# EAGLE design project (EAGLE 9.4.2)
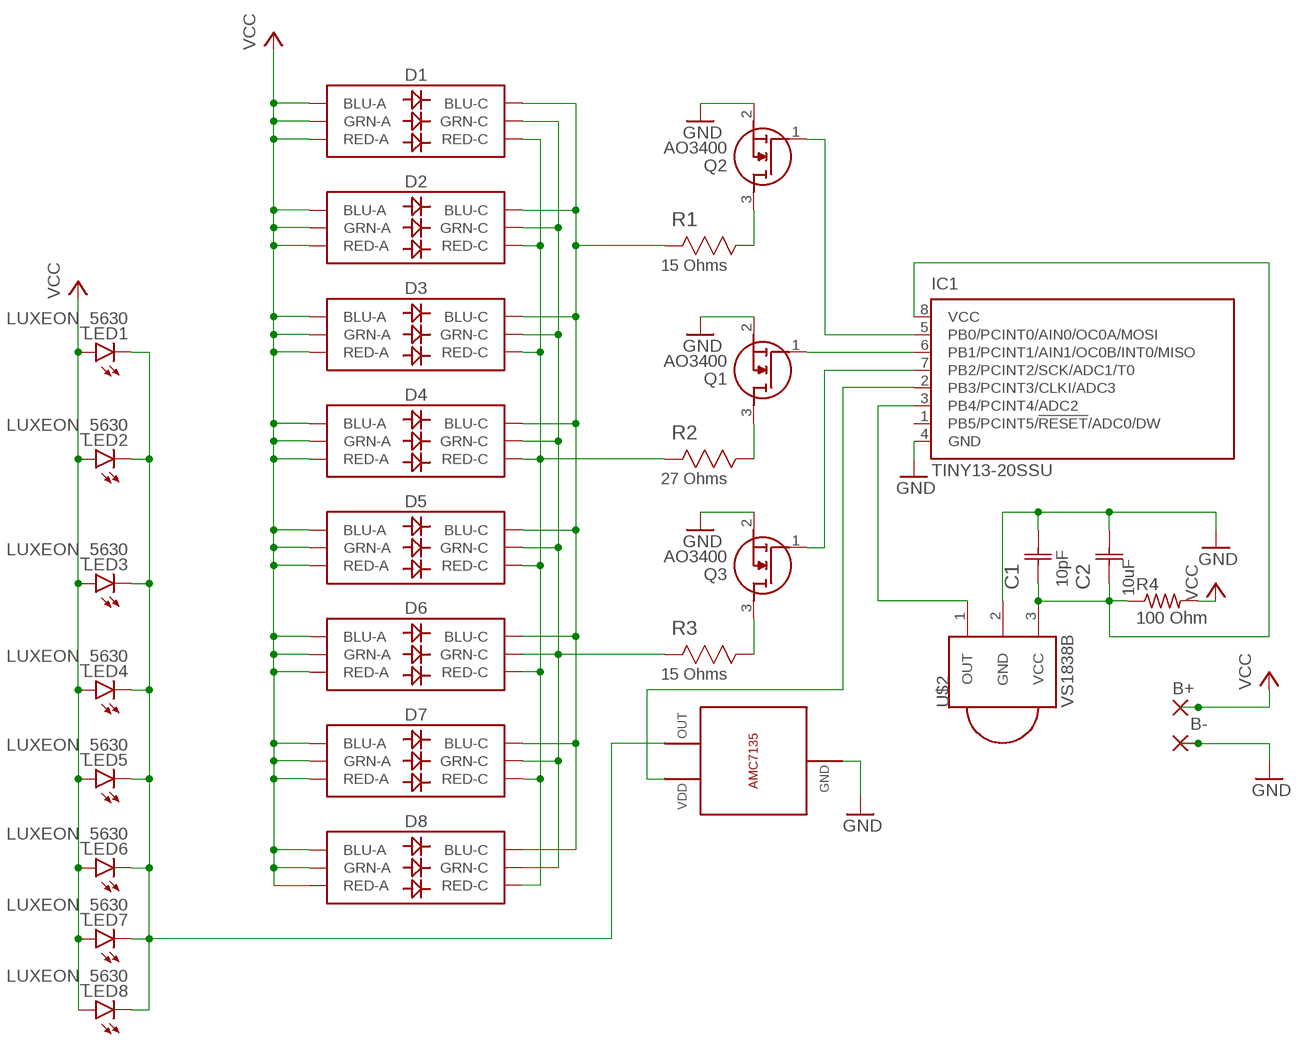
[diagram p0: schematic, sheet 1]

## Parts
B+  WIREPADSMD1,27-254  [SMD1,27-2,54]
B-  WIREPADSMD1,27-254  [SMD1,27-2,54]
C1  10pF  08051A100JAT2A  [CAPC2013X94N]
C2  10uF  12061A101JAT2A  [CAPC3216X94N]
D1  LED-RGBNO_IC  [LED-TRICOLOR-5050]
D2  LED-RGBNO_IC  [LED-TRICOLOR-5050]
D3  LED-RGBNO_IC  [LED-TRICOLOR-5050]
D4  LED-RGBNO_IC  [LED-TRICOLOR-5050]
D5  LED-RGBNO_IC  [LED-TRICOLOR-5050]
D6  LED-RGBNO_IC  [LED-TRICOLOR-5050]
D7  LED-RGBNO_IC  [LED-TRICOLOR-5050]
D8  LED-RGBNO_IC  [LED-TRICOLOR-5050]
IC1  TINY13-20SSU  [8S1]
LED1  LUXEON_5630  [LUXEON_5630]
LED2  LUXEON_5630  [LUXEON_5630]
LED3  LUXEON_5630  [LUXEON_5630]
LED4  LUXEON_5630  [LUXEON_5630]
LED5  LUXEON_5630  [LUXEON_5630]
LED6  LUXEON_5630  [LUXEON_5630]
LED7  LUXEON_5630  [LUXEON_5630]
LED8  LUXEON_5630  [LUXEON_5630]
Q1  AO3400  [SOT95P280X125-3N]
Q2  AO3400  [SOT95P280X125-3N]
Q3  AO3400  [SOT95P280X125-3N]
R1  15 Ohms  CRCW1206130RFKEA  [RESC3216X71N]
R2  27 Ohms  CRCW1206130RFKEA  [RESC3216X71N]
R3  15 Ohms  CRCW1206130RFKEA  [RESC3216X71N]
R4  100 Ohm  R-US_R0805  [R0805]
U$1  AMC7135  [AMC7135]
U$2  VS1838B  PNA460XM  [PNA460XM]

## Nets
GND: B-.1(P) C1.2(C2) C2.2(C2) IC1.4(GND) Q1.2(S) Q2.2(S) Q3.2(S) U$1.GND U$1.TAB(GND) U$2.2(GND)
N$1: LED1.1@1(C) LED1.1@2(C) LED2.1@1(C) LED2.1@2(C) LED3.1@1(C) LED3.1@2(C) LED4.1@1(C) LED4.1@2(C) LED5.1@1(C) LED5.1@2(C) LED6.1@1(C) LED6.1@2(C) LED7.1@1(C) LED7.1@2(C) LED8.1@1(C) LED8.1@2(C) U$1.OUT
N$2: IC1.5(PB0/PCINT0/AIN0/OC0A/MOSI) Q2.1(G)
N$3: IC1.6(PB1/PCINT1/AIN1/OC0B/INT0/MISO) Q1.1(G)
N$4: IC1.7(PB2/PCINT2/SCK/ADC1/T0) Q3.1(G)
N$5: Q2.3(D) R1.1(R1)
N$6: Q1.3(D) R2.1(R1)
N$7: Q3.3(D) R3.1(R1)
N$8: D1.5(RED-C) D2.5(RED-C) D3.5(RED-C) D4.5(RED-C) D5.5(RED-C) D6.5(RED-C) D7.5(RED-C) D8.5(RED-C) R2.2(R2)
N$9: D1.6(GRN-C) D2.6(GRN-C) D3.6(GRN-C) D4.6(GRN-C) D5.6(GRN-C) D6.6(GRN-C) D7.6(GRN-C) D8.6(GRN-C) R3.2(R2)
N$10: D1.4(BLU-C) D2.4(BLU-C) D3.4(BLU-C) D4.4(BLU-C) D5.4(BLU-C) D6.4(BLU-C) D7.4(BLU-C) D8.4(BLU-C) R1.2(R2)
N$11: IC1.3(PB4/PCINT4/ADC2) U$2.1(OUT)
N$12: IC1.2(PB3/PCINT3/CLKI/ADC3) U$1.VDD
N$14: C1.1(C1) C2.1(C1) IC1.8(VCC) R4.1 U$2.3(VCC)
VCC: B+.1(P) D1.1(GRN-A) D1.2(RED-A) D1.3(BLU-A) D2.1(GRN-A) D2.2(RED-A) D2.3(BLU-A) D3.1(GRN-A) D3.2(RED-A) D3.3(BLU-A) D4.1(GRN-A) D4.2(RED-A) D4.3(BLU-A) D5.1(GRN-A) D5.2(RED-A) D5.3(BLU-A) D6.1(GRN-A) D6.2(RED-A) D6.3(BLU-A) D7.1(GRN-A) D7.2(RED-A) D7.3(BLU-A) D8.1(GRN-A) D8.2(RED-A) D8.3(BLU-A) LED1.2(A) LED2.2(A) LED3.2(A) LED4.2(A) LED5.2(A) LED6.2(A) LED7.2(A) LED8.2(A) R4.2
Unconnected: IC1.1(PB5/PCINT5/!RESET!/ADC0/DW)

## Library data of the parts
B+ B- = wirepad:WIREPAD: Wire PAD connect wire on PCB
C1 = C_0805:08051A100JAT2A: Capacitor 0805; MPN: 08051A100JAT2A; OC_FARNELL: 499158; OC_NEWARK: 96K4767; SUPPLIER: AVX; TOLERANCE: ±5%; VOLTAGERATING: 100V
C2 = C_1206:12061A101JAT2A; DESCRIPTION: Capacitor 1206; MPN: 12061A101JAT2A; OC_FARNELL: 499274; OC_NEWARK: 27C4497; SUPPLIER: AVX; TOLERANCE: ±5%; VALUE: 100PF; VOLTAGERATING: 100V
D1-D8 = SparkFun-LED:LED-RGB: LED-RGB 6 pin RGB LED (no common connector) Packages: PLCC-6 LED-TRICOLOR-5050 - No built-in IC SparkFun Products: Digital Sandbox <https://www.sparkfun.com/products/12651> LED- SMD RGB <https://www.sparkfun.com/products/10866>; PROD_ID: DIO-10298
IC1 = atmel:TINY13: 8-bit AVR Microcontroller with 1K Bytes In-System Programmable Flash Source: http://www.atmel.com/dyn/resources/prod_documents/2535S.pdf; MPN: ATTINY13-20SSU; OC_FARNELL: 1455133; OC_NEWARK: 58M3771
LED1-LED8 = led:LUXEON_5630: LUXEON 5630 Mid-Power LEDs SD201 Source: Data sheet <www.philipslumileds.com/uploads/351/DS201-pdf> Lumileds 5630 Datasheet DS201 20130228 ©2013 Philips Lumileds Lighting Company.
Q1-Q3 = AO3400:AO3400: 30V N-Channel MOSFET Source: Datasheet <http://aosmd.com/res/data_sheets/AO3400.pdf>; ARROW_PART_NUMBER: AO3400; ARROW_PRICE/STOCK: https://www.arrow.com/en/products/ao3400/alpha-and-omega-semiconductor; DESCRIPTION: 30V N-Channel MOSFET; HEIGHT: 1.25mm; MANUFACTURER_NAME: Alpha & Omega Semiconductors; MANUFACTURER_PART_NUMBER: AO3400
R1-R3 = R_1206:CRCW1206130RFKEA: RESISTOR, 1206; MPN: CRCW1206130RFKEA; OC_FARNELL: 1692541; OC_NEWARK: 53K1973; SUPPLIER: Vishay; TOLERANCE: ±1%; VALUE: 130 Ohms; WATTAGE: 0.25W
R4 = rcl:R-US_: RESISTOR, American symbol; SPICEPREFIX: R
U$1 = dan:AMC7135
U$2 = adafruit:PNA460XM: IR 38KHz receiver PNA4602 and related receivers http://www.ladyada.net/library/pcb/eaglelibrary.html

## Board
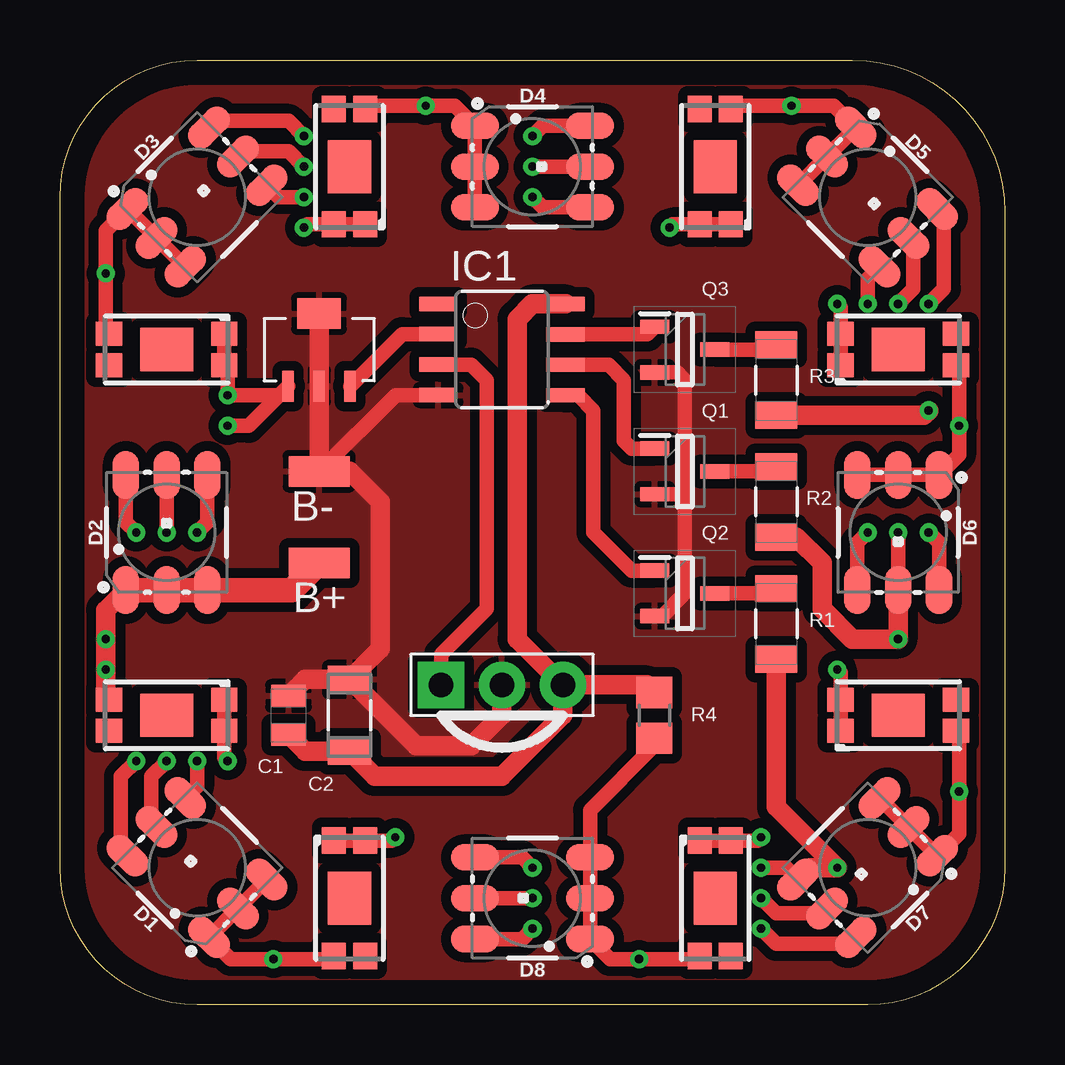
[diagram p1: board, top side]
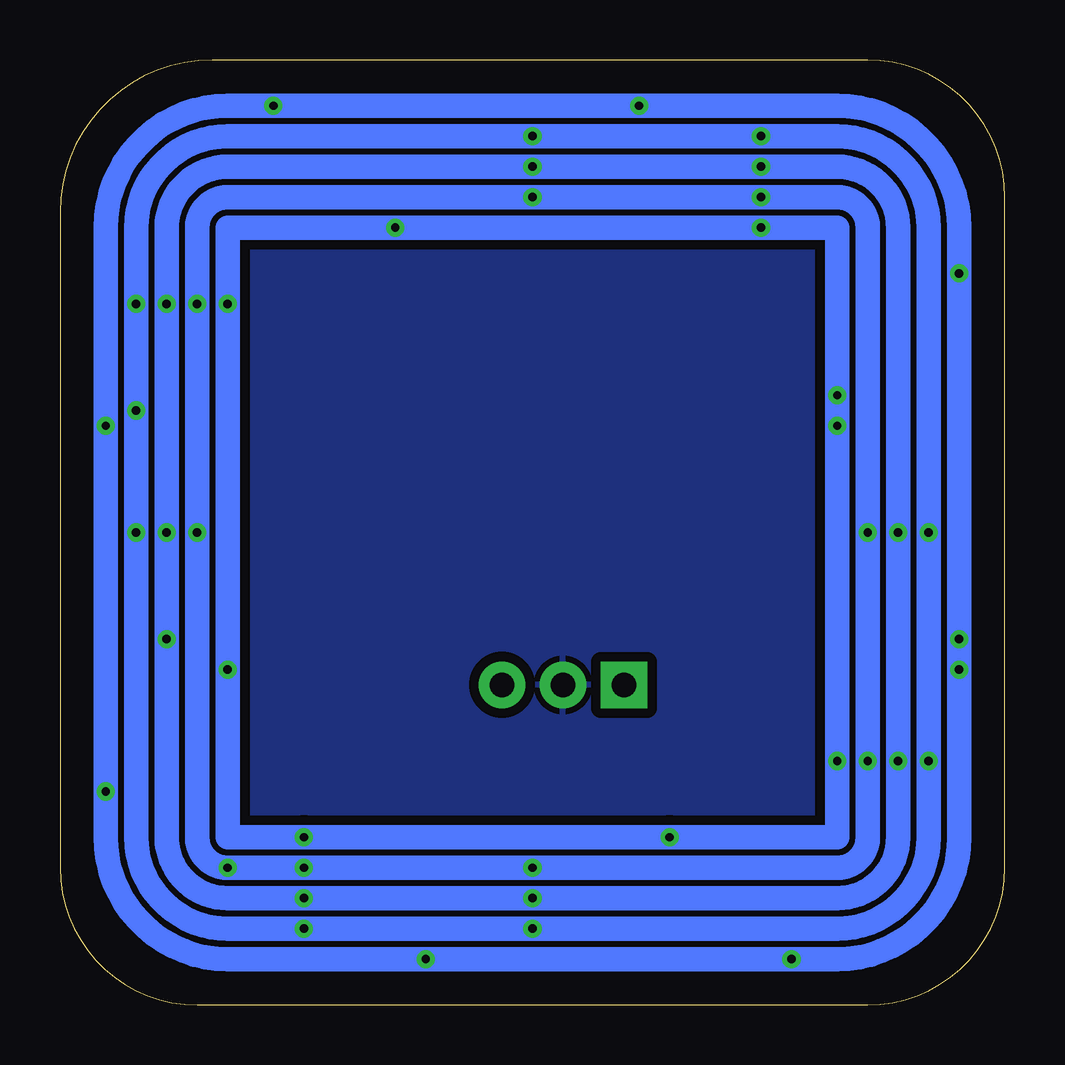
[diagram p2: board, bottom side, seen from below]

Size 39.37 x 39.37 mm. Coordinates in mm from the lower left corner, seen from the top.
Outline: 33.02,39.37 arc-90 39.37,33.02 39.37,5.71 arc-90 33.66,0 5.71,0 arc-90 0,5.71 0,33.66 arc-90 5.71,39.37 33.02,39.37
Copper layers (1*16): Top 0.035mm / dielectric 1.5mm / Bottom 0.035mm
Design rules "default *": minimum track width 6mil, minimum drill 0.35mm, track to track 6mil, track to pad 6mil, pad to pad 6mil, via to via 6mil, smd to smd 6mil, copper to edge 40mil, drill to drill 6mil, minimum pad ring 10mil, minimum via ring 8mil, stop-mask expansion 4mil, vias tented up to drill 14mil, thermal gap 10mil

### Footprints (pad centres in the part's own frame; a part is rotated, then mirrored left to right if it is on the bottom)
SMD1,27-2,54 = smd 1.27 x 2.54: 1 0,0
CAPC2013X94N = smd 0.914 x 1.448: 1 -0.813,0; 2 0.813,0
CAPC3216X94N = smd 1.118 x 1.803: 1 -1.499,0; 2 1.499,0
LED-TRICOLOR-5050 = smd 2 x 1.1: 1 -2.4,1.7; 2 -2.4,0; 3 -2.4,-1.7; 4 2.4,-1.7; 5 2.4,0; 6 2.4,1.7
8S1 = smd 0.6 x 1.6: 1 -1.905,-2.654; 2 -0.645,-2.654; 3 0.625,-2.654; 4 1.895,-2.654; 5 1.905,2.654; 6 0.635,2.654; 7 -0.635,2.654; 8 -1.905,2.654
LUXEON_5630 = smd 1.1 x 1: 1@1 -2.4,-0.65; 1@2 -2.4,0.65; 2 2.4,-0.65; 4 2.4,0.65 | smd 2.2 x 1.8: 3 0,0
SOT95P280X125-3N = smd 1.2 x 0.6: 1 -1.25,0.95; 2 -1.25,-0.95; 3 1.25,0
RESC3216X71N = smd 1.118 x 1.753: 1 -1.473,0; 2 1.473,0
R0805 = smd 1.3 x 1.5: 1 -0.95,0; 2 0.95,0
AMC7135 = smd 0.48 x 1.29: GND 0,-1.525; OUT -1.29,-1.525; VDD 1.29,-1.525 | smd 1.82 x 1.27: TAB 0,1.499
PNA460XM = drill 1.016 pad 1.93 square: 1 -2.54,0 | drill 1.016 pad 1.93: 2 0,0; 3 2.54,0

### Placement (x,y rotation side)
B+  10.79,18.41 90 top
B-  10.79,22.23 90 top
C1  9.53,12.06 90 top
C2  12.06,12.06 90 top
D1  5.71,5.71 135 top
D2  4.45,19.68 90 top
D3  5.71,33.66 45 top
D4  19.68,34.92 0 top
D5  33.66,33.66 315 top
D6  34.92,19.68 270 top
D7  33.66,5.71 225 top
D8  19.68,4.45 180 top
IC1  18.41,27.3 270 top
LED1  4.45,12.06 180 top
LED2  4.45,27.3 180 top
LED3  12.06,34.92 90 top
LED4  27.3,34.92 90 top
LED5  34.92,27.3 0 top
LED6  34.92,12.06 0 top
LED7  27.3,4.45 270 top
LED8  12.06,4.45 270 top
Q1  26.04,22.23 0 top
Q2  26.04,17.14 0 top
Q3  26.04,27.3 0 top
R1  29.84,15.88 270 top
R2  29.84,20.95 270 top
R3  29.84,26.04 270 top
R4  24.77,12.06 270 top
U$1  10.79,27.3 0 top
U$2  18.41,13.34 0 top

### Tracks (layer width: path | path; a pad name or v marks a point on that pad's centre or on a via)
GND
  Top 0.61: IC1.4 13.98,25.41 B-.1 | Q3.2 25.71,26.36 26.04,26.04 26.04,20.95 | 26.04,20.95 26.04,17.14 25.09,16.2 Q2.2 | Q1.2 25.71,21.27 26.04,20.95
  Top 0.813: C2.2 14.83,10.79 17.14,10.79 18.41,12.06 U$2.2 | C1.2 10.21,13.56 C2.2 | C2.2 13.34,14.83 13.34,20.95 12.06,22.23 B-.1 U$1.GND U$1.TAB
  pour Bottom (isolate 0.406): 5.71,33.66 33.66,33.66 33.66,5.71 5.71,5.71
  pour Top (isolate 0.406): -1.27,39.37 0,40.64 40.64,40.64 40.64,1.27 38.1,-1.27 31.75,-1.27 0,-1.27 -1.91,0.64 -1.91,38.73
N$1  (via drill 0.35)
  Top 0.61: v10.16,32.38 10.3,32.52 LED3.1@2 LED3.1@1 | v6.99,10.16 6.84,10.3 LED1.1@2 LED1.1@1 | v13.97,6.99 13.83,6.84 LED8.1@2 LED8.1@1 | v29.21,6.99 29.07,6.84 LED7.1@2 LED7.1@1 | v32.38,13.97 32.52,13.83 LED6.1@2 LED6.1@1 | v32.38,29.21 32.52,29.07 LED5.1@2 LED5.1@1 | v25.4,32.38 25.54,32.52 LED4.1@2 LED4.1@1 | v6.99,24.13 7.86,24.13 U$1.OUT 9.12,25.4 v6.99,25.4 6.99,26.52 LED2.1@2 LED2.1@1
  Bottom 1.016: 32.38,32.38 v32.38,29.21 v32.38,13.97 32.38,6.99 v29.21,6.99 v13.97,6.99 6.99,6.99 v6.99,10.16 v6.99,24.13 v6.99,25.4 6.99,32.38 v10.16,32.38 v25.4,32.38 32.38,32.38
N$2
  Top 0.61: IC1.5 21.59,25.4 22.23,24.77 22.23,19.68 23.82,18.09 Q2.1
N$3
  Top 0.61: IC1.6 22.86,26.67 23.5,26.04 23.5,23.5 23.82,23.18 Q1.1
N$4
  Top 0.61: IC1.7 24.47,27.94 Q3.1
N$5
  Top 0.61: Q2.3 29.64,17.14 R1.1
N$6
  Top 0.61: Q1.3 29.64,22.23 R2.1
N$7
  Top 0.61: Q3.3 29.64,27.3 R3.1
N$8  (via drill 0.35)
  Top 0.61: v19.68,34.92 D4.5 | D6.5 v34.92,19.68 | D8.5 v19.68,4.45 | D2.5 v4.45,19.68 | v10.16,34.92 9.53,35.56 7.62,35.56 D3.5 | v34.92,29.21 35.56,29.84 35.56,31.75 D5.5 | v29.21,4.45 29.84,3.81 31.75,3.81 D7.5 | v4.45,10.16 3.81,9.53 3.81,7.62 D1.5
  Top 0.813: R2.2 30.68,19.48 31.75,18.41 31.75,16.51 33.02,15.24 v34.92,15.24 D6.5
  Bottom 1.016: 32.38,34.92 arc-90 34.92,32.38 v34.92,29.21 v34.92,19.68 v34.92,15.24 34.92,6.99 arc-90 32.38,4.45 v29.21,4.45 v19.68,4.45 6.99,4.45 arc-90 4.45,6.99 v4.45,10.16 v4.45,19.68 4.45,32.38 arc-90 6.99,34.92 v10.16,34.92 v19.68,34.92 32.38,34.92
N$9  (via drill 0.35)
  Top 0.61: v19.68,36.2 20.11,36.62 D4.6 | D6.6 36.62,19.25 v36.2,19.68 | D8.6 19.25,2.75 v19.68,3.17 | D2.6 2.75,20.11 v3.17,19.68 | v10.16,36.2 9.53,36.83 6.49,36.83 D3.6 | v36.2,29.21 36.83,29.84 36.83,32.88 D5.6 | v29.21,3.17 29.84,2.54 32.88,2.54 D7.6 | v3.17,10.16 2.54,9.53 2.54,6.49 D1.6
  Top 0.813: R3.2 35.99,24.56 v36.2,24.77
  Bottom 1.016: 32.38,36.2 arc-90 36.2,32.38 v36.2,29.21 v36.2,24.77 v36.2,19.68 36.2,6.99 arc-90 32.38,3.17 v29.21,3.17 v19.68,3.17 6.99,3.17 arc-90 3.17,6.99 v3.17,10.16 v3.17,19.68 3.17,32.38 arc-90 6.99,36.2 v10.16,36.2 v19.68,36.2 32.38,36.2
N$10  (via drill 0.35)
  Top 0.61: v19.68,33.66 20.11,33.23 D4.4 | D6.4 33.23,19.25 v33.66,19.68 | D8.4 19.25,6.14 v19.68,5.71 | D2.4 6.14,20.11 v5.71,19.68 | v10.16,33.66 9.11,33.66 D3.4 | v33.66,29.21 33.66,30.26 D5.4 | v29.21,5.71 30.26,5.71 D7.4 | v5.71,10.16 5.71,9.11 D1.4
  Top 0.813: R1.2 29.84,8.26 v32.38,5.71 31.25,5.71 D7.4
  Bottom 1.016: 32.38,33.66 arc-90 33.66,32.38 v33.66,29.21 v33.66,19.68 33.66,6.99 arc-90 v32.38,5.71 v29.21,5.71 v19.68,5.71 6.99,5.71 arc-90 5.71,6.99 v5.71,10.16 v5.71,19.68 5.71,32.38 arc-90 6.99,33.66 v10.16,33.66 v19.68,33.66 32.38,33.66
N$11
  Top 0.61: IC1.3 17.14,26.68 17.78,26.04 17.78,16.51 15.88,14.61 U$2.1
N$12
  Top 0.61: U$1.VDD 14.26,27.95 IC1.2
N$14
  Top 0.813: R4.1 24.45,13.34 U$2.3 | U$2.3 20.95,12.06 18.41,9.53 13.11,9.53 C2.1 10.21,10.57 C1.1 | IC1.8 19.68,29.21 19.05,28.57 19.05,15.24 U$2.3
VCC  (via drill 0.35)
  Top 0.61: LED1.2 1.91,12.86 v1.91,13.97 | LED7.2 26.52,1.91 v24.13,1.91 22.93,1.91 D8.1 D8.2 D8.3 22.09,8.12 24.77,10.79 R4.2 | LED5.2 37.47,26.52 v37.47,24.13 37.47,22.93 D6.1 D6.2 D6.3 | LED3.2 12.86,37.47 v15.24,37.47 16.45,37.47 D4.1 D4.3 D4.2 | LED8.2 11.28,1.91 v8.89,1.91 7.12,1.91 D1.1 | LED6.2 37.47,11.28 v37.47,8.89 37.47,7.12 D7.1 | LED4.2 28.09,37.47 v30.48,37.47 32.25,37.47 D5.1 32.91,36.3 | LED2.2 1.91,28.09 v1.91,30.48 1.91,32.25 D3.1 | D1.3 D1.1 | D1.2 D1.1 | D1.1 | D5.2 | D5.2 D5.3 32.91,36.3 | D5.2 32.91,36.3 | 32.91,36.3 | D3.3 D3.1 | D3.2 D3.1 | D3.1 | D7.3 D7.1 | D7.2 D7.1 | D7.1 | D2.3 D2.2
  Top 0.813: D2.1 1.91,16.45 1.91,12.86
  Top 1.016: B+.1 9.66,17.29 D2.2 D2.1
  Bottom 1.016: 32.38,37.47 arc-90 37.47,32.38 v37.47,24.13 v37.47,8.89 37.47,6.99 arc-90 32.38,1.91 v24.13,1.91 v8.89,1.91 6.99,1.91 arc-90 1.91,6.99 v1.91,13.97 v1.91,15.24 v1.91,30.48 1.91,32.38 arc-90 6.99,37.47 v15.24,37.47 v30.48,37.47 32.38,37.47